# EAGLE design A18-BQ (EAGLE 4.13)
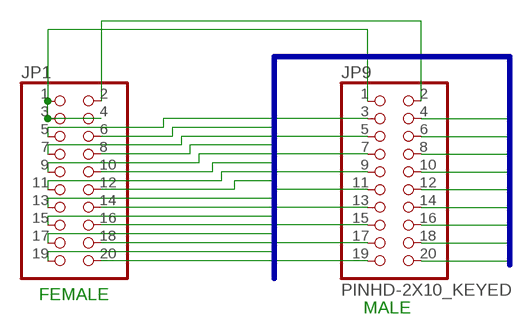
[diagram p0: schematic, sheet 1]

## Parts
JP1  PINHD-2X10  [2X10]
JP9  PINHD-2X10_KEYED  [2X10_KEYED]

## Nets
CH1: JP1.13 JP9.12
CH2: JP1.5 JP9.3
CH3: JP1.14 JP9.13
CH4: JP1.6 JP9.4
CH5: JP1.15 JP9.14
CH6: JP1.7 JP9.5
CH7: JP1.16 JP9.15
CH8: JP1.8 JP9.6
CH9: JP1.17 JP9.16
CH10: JP1.9 JP9.7
CH11: JP1.18 JP9.17
CH12: JP1.10 JP9.8
CH13: JP1.19 JP9.18
CH14: JP1.11 JP9.9
CH15: JP1.20 JP9.19
CH16: JP1.12 JP9.10
CH17: JP9.20
CH18: JP9.11
CUR-SENSE: JP1.1 JP1.3 JP1.4 JP9.1
GND: JP1.2 JP9.2

## Buses
HDR$:GND,CH[0..18]

## Notes on the sheet
- FEMALE
- MALE

## Library data of the parts
JP1 = pinhead:PINHD-2X10: PIN HEADER
JP9 = pinhead:PINHD-2X10_KEYED

## Board
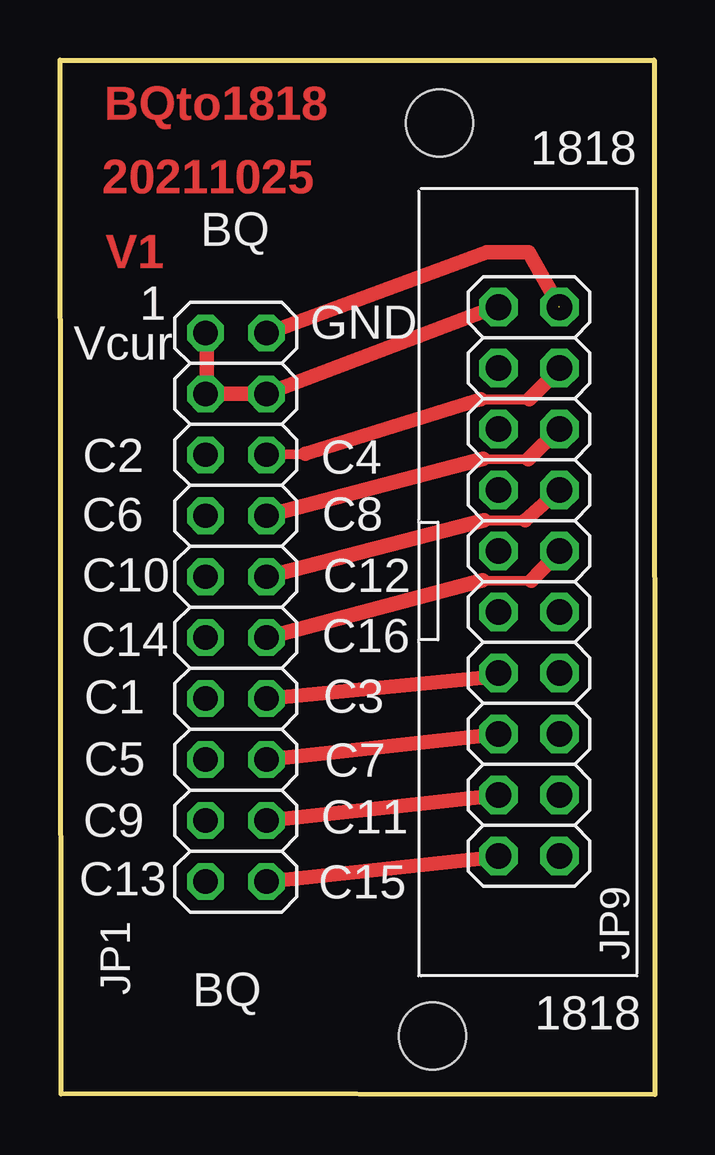
[diagram p1: board, top side]
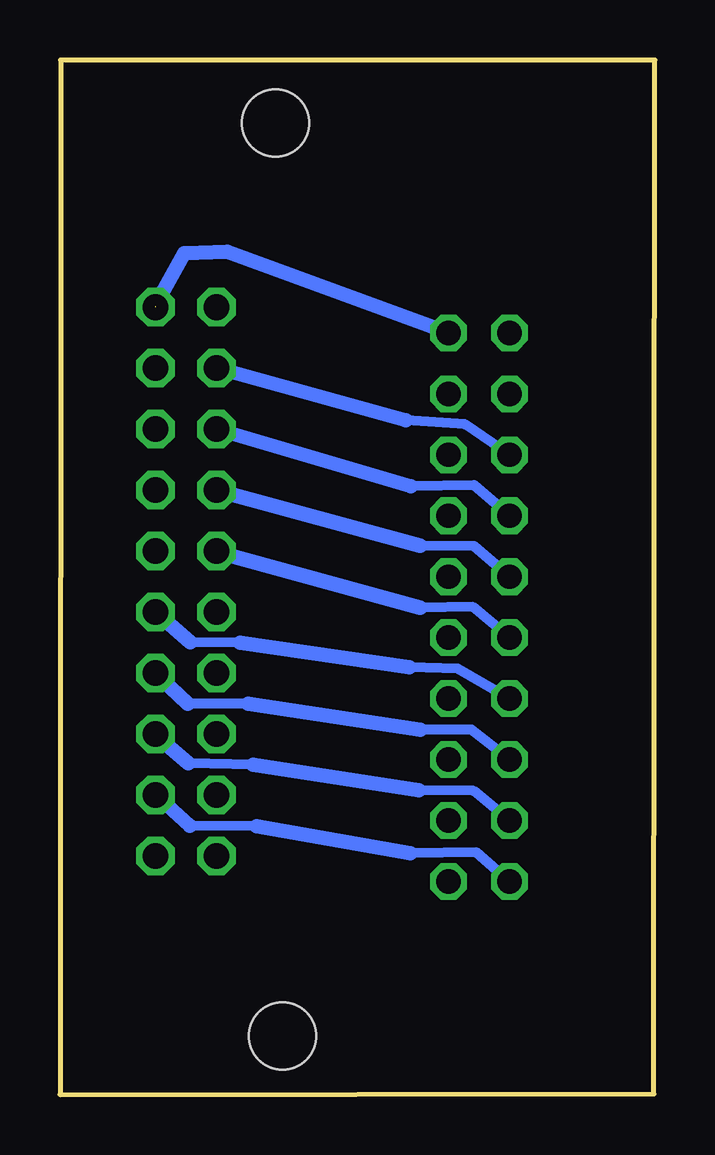
[diagram p2: board, bottom side, seen from below]

Size 24.79 x 43.11 mm. Coordinates in mm from the lower left corner, seen from the top.
Outline: 0.05,0.03 0,43.1 24.76,43.11 24.79,0 0.05,0.03
Copper layers (1*16): Top 0.035mm / dielectric 1.5mm / Bottom 0.035mm
Design rules "default": minimum track width 8mil, minimum drill 0.6mm, track to track 8mil, track to pad 8mil, pad to pad 8mil, via to via 8mil, smd to smd 0mil, copper to edge 8mil, drill to drill 8mil, minimum pad ring 10mil, minimum via ring 8mil, stop-mask expansion 4mil, vias tented up to drill 0mil, thermal gap 10mil
Holes 2.8 mm at 15.81,40.48 15.52,2.44

### Footprints (pad centres in the part's own frame; a part is rotated, then mirrored left to right if it is on the bottom)
2X10 = drill 1.016 octagon: 1 -11.43,-1.27; 2 -11.43,1.27; 3 -8.89,-1.27; 4 -8.89,1.27; 5 -6.35,-1.27; 6 -6.35,1.27; 7 -3.81,-1.27; 8 -3.81,1.27; 9 -1.27,-1.27; 10 -1.27,1.27; 11 1.27,-1.27; 12 1.27,1.27; 13 3.81,-1.27; 14 3.81,1.27; 15 6.35,-1.27; 16 6.35,1.27; 17 8.89,-1.27; 18 8.89,1.27; 19 11.43,-1.27; 20 11.43,1.27
2X10_KEYED = drill 1.067 octagon: 1 -11.46,-1.27; 2 -11.46,1.27; 3 -8.92,-1.27; 4 -8.92,1.27; 5 -6.38,-1.27; 6 -6.38,1.27; 7 -3.84,-1.27; 8 -3.84,1.27; 9 -1.3,-1.27; 10 -1.3,1.27; 11 1.24,-1.27; 12 1.24,1.27; 13 3.78,-1.27; 14 3.78,1.27; 15 6.32,-1.27; 16 6.32,1.27; 17 8.86,-1.27; 18 8.86,1.27; 19 11.4,-1.27; 20 11.4,1.27

### Placement (x,y rotation side)
JP1  7.33,20.31 270 top
JP9  19.54,21.35 270 top

### Tracks (layer width: path | path; a pad name or v marks a point on that pad's centre or on a via)
CH1
  Bottom 0.406: JP1.13 8.22,17.75 10.24,17.8 | 17.29,18.83 19.37,18.86 | 20.89,20.19 JP9.12
  Bottom 0.61: 10.24,17.8 17.29,18.83 | 19.37,18.86 20.89,20.19
CH2
  Bottom 0.406: JP1.5 7.91,27.93 10.38,28.1 | 18.36,30.3 JP9.3
  Bottom 0.61: 10.38,28.1 18.36,30.3
CH3
  Top 0.406: 18.46,17.46 JP9.13
  Top 0.61: JP1.14 18.46,17.46
CH4
  Top 0.406: JP1.6 10.21,26.7 | 17.53,28.98 19.55,28.98 | 20.98,30.42 JP9.4
  Top 0.61: 10.21,26.7 17.53,28.98 | 19.55,28.98 20.98,30.42
CH5
  Bottom 0.406: JP1.15 7.65,15.21 9.79,15.21 | 16.94,16.29 19.46,16.29 | 20.91,17.65 JP9.14
  Bottom 0.61: 9.79,15.21 16.94,16.29 | 19.46,16.29 20.91,17.65
CH6
  Bottom 0.406: JP1.7 7.53,25.4 10.17,25.36 | 18.32,27.75 JP9.5
  Bottom 0.61: 10.17,25.36 18.32,27.75
CH7
  Top 0.406: 18.39,15.03 JP9.15
  Top 0.61: JP1.16 18.39,15.03
CH8
  Top 0.406: 17.63,26.49 19.51,26.47 | 20.84,27.78 JP9.6
  Top 0.61: JP1.8 17.63,26.49 | 19.51,26.47 20.84,27.78
CH9
  Bottom 0.406: JP1.17 7.56,12.66 9.84,12.69 | 16.74,13.74 19.44,13.8 | 20.94,15.11 JP9.16
  Bottom 0.61: 9.84,12.69 16.74,13.74 | 19.44,13.8 20.94,15.11
CH10
  Bottom 0.406: JP1.9 7.53,22.86 9.79,22.88
  Bottom 0.61: 9.79,22.88 JP9.7
CH11
  Top 0.406: 18.42,12.49 JP9.17
  Top 0.61: JP1.18 18.42,12.49
CH12
  Top 0.406: 17.68,23.93 19.39,23.93 | 20.84,25.23 JP9.8
  Top 0.61: JP1.10 17.68,23.93 | 19.39,23.93 20.84,25.23
CH13
  Bottom 0.406: JP1.19 7.44,10.09 10.19,10.05 | 16.6,11.18 19.39,11.21 | 20.77,12.47 JP9.18
  Bottom 0.61: 10.19,10.05 16.6,11.18 | 19.39,11.21 20.77,12.47
CH14
  Bottom 0.406: JP1.11 7.6,20.32 9.77,20.29 | 18.37,22.64 JP9.9
  Bottom 0.61: 9.77,20.29 18.37,22.64
CH15
  Top 0.406: 18.27,9.92 JP9.19
  Top 0.61: JP1.20 18.27,9.92
CH16
  Top 0.406: 17.61,21.43 19.63,21.41 | 20.87,22.71 JP9.10
  Top 0.61: JP1.12 17.61,21.43 | 19.63,21.41 20.87,22.71
CUR-SENSE
  Top 0.406: 6.11,29.12 6.11,29.2 JP1.3 | 6.11,31.74 JP1.1 | JP1.4 8.82,29.2 8.82,29.08 | 18.44,32.93 JP9.1
  Top 0.61: 6.11,29.2 6.11,31.74 | JP1.3 JP1.4 18.44,32.93
GND  (1 unrouted)
  Top 0.61: 8.63,31.72 17.79,35.09 19.53,35.1 20.8,32.84
  Bottom 0.406: 20.86,32.8 JP9.2
  Bottom 0.61: JP1.2 17.83,35.12 19.61,35.05 20.86,32.8

### Text on the board
Top: BQto1818 | 20211025 | V1
tNames: 1818 | BQ | 1 | GND | Vcur | C2 | C4 | C6 | C8 | C10 | C12 | C16 | C14 | C1 | C3 | C5 | C7 | C9 | C11 | C13 | C15 | BQ | 1818
tValues: 3.3V | DIGITAL | +5V | 3.2v | ANALOG | 3.2